# EAGLE design Rev 1 (EAGLE 7.2.0)
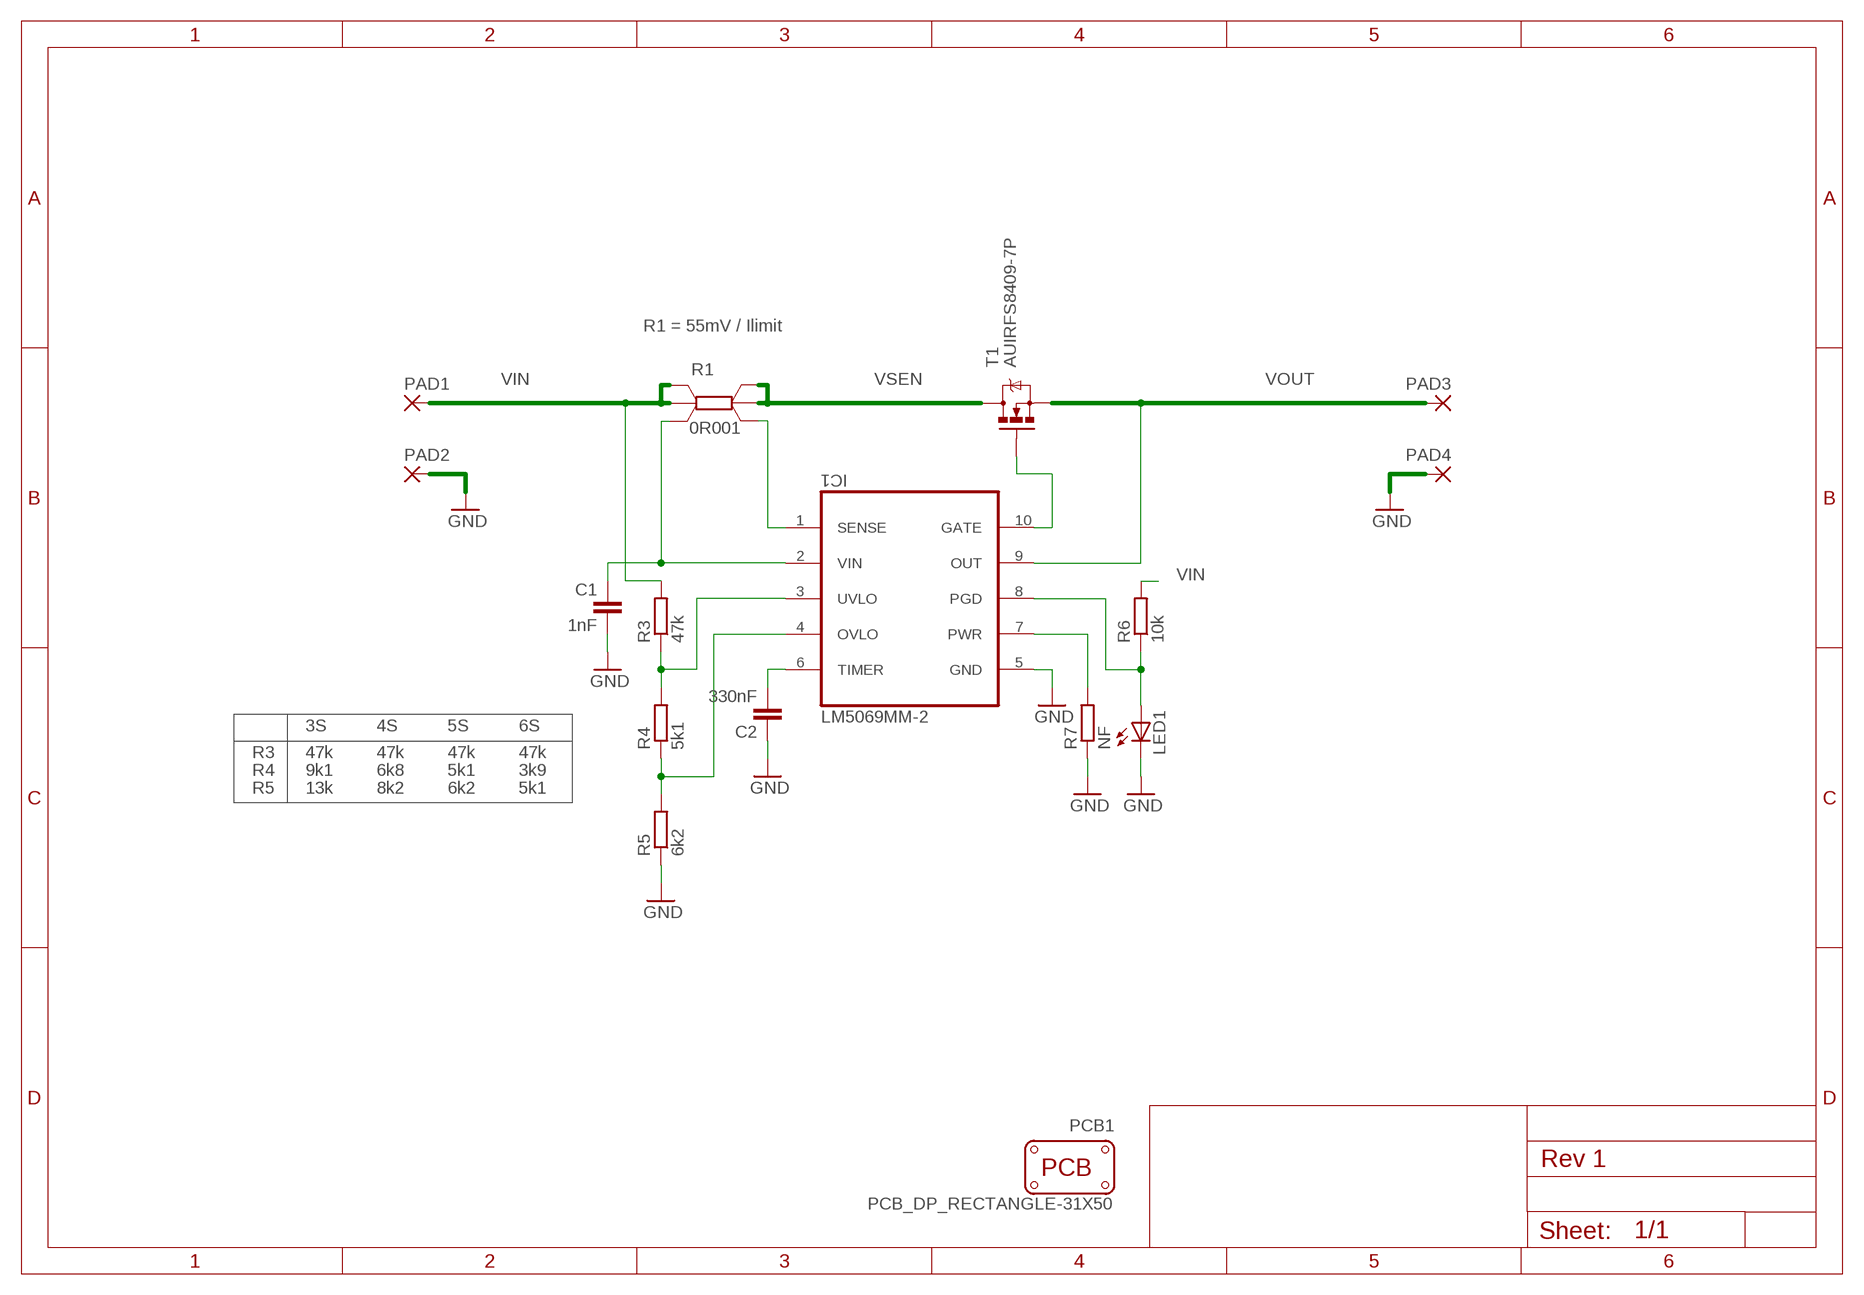
[diagram p0: schematic, sheet 1]

## Parts
C1  1nF  C-EUC0603  [C0603]
C2  330nF  C-EUC0603  [C0603]
IC1  LM5069MM-2  [SOP50P490X110-10N]
LED1  LED-0805  [LED-805]
PAD1  SMD7  [SMD3,81-7,62]
PAD2  SMD7  [SMD3,81-7,62]
PAD3  SMD7  [SMD3,81-7,62]
PAD4  SMD7  [SMD3,81-7,62]
PCB1  PCB_DP_RECTANGLE-31X50  [DP5031_V1]
R1  0R001  OARS_XP  [OARS_SP_4PAD]
R3  47k  R-EU_R0603  [R0603]
R4  5k1  R-EU_R0603  [R0603]
R5  6k2  R-EU_R0603  [R0603]
R6  10k  R-EU_R0603  [R0603]
R7  NF  R-EU_R0603  [R0603]
T1  AUIRFS8409-7P  IRFS7437-7PPBF  [TO263-6]

## Nets
CTIMER: C2.2 IC1.6(TIMER)
GATE_DRIVE: IC1.10(GATE) T1.1(G)
GND: C1.2 C2.1 IC1.5(GND) LED1.C PAD2.1(P) PAD4.1(P) R5.1 R7.1
OVLO: IC1.4(OVLO) R4.1 R5.2
PGD: IC1.8(PGD) LED1.A R6.1
POWER: IC1.7(PWR) R7.2
SENSE: IC1.1(SENSE) R1.AK
UVLO: IC1.3(UVLO) R3.1 R4.2
VIN: PAD1.1(P) R1.B1 R1.B2 R3.2 R6.2
VIN_K: C1.1 IC1.2(VIN) R1.BK
VOUT: IC1.9(OUT) PAD3.1(P) T1.2(S) T1.3(S) T1.4(S) T1.5(S) T1.6(S)
VSEN: R1.A1 R1.A2 T1.TH(D)

## Notes on the sheet
- R1 = 55mV / Ilimit
- 3S | 4S | 5S | 6S
- R3 | 47k | 47k | 47k | 47k
- R4 | 9k1 | 6k8 | 5k1 | 3k9
- R5 | 13k | 8k2 | 6k2 | 5k1

## Library data of the parts
C1 = rcl:C-EU: CAPACITOR, European symbol; MF: VISHAY; MPN: VJ0603Y102KXBAC31; OC_FARNELL: 2407359
C2 = rcl:C-EU: CAPACITOR, European symbol; MF: TDK; MPN: C1608X7R1E334K080AC; OC_FARNELL: 2346902
IC1 = general:LM5069MM-2: Current controller; MF: TEXAS INSTRUMENTS; MPN: LM5069MM-2; OC_FARNELL: 1290933; OC_NEWARK: 13M1902; PACKAGE: MSOP-10; SUPPLIER: National
LED1 = dp_devices:LED: Light Emitting Diode; MF: ROHM; MPN: SML-211UTT86K; OC_FARNELL: 1685056
PAD1-PAD4 = wirepad:SMD7; OC_FARNELL: unknown
PCB1 = dp_devices:PCB_DP_RECTANGLE: Dangerous Prototypes Standard Rectangular PCB sizes; OC_FARNELL: unknown
R1 = general:OARS_XP; MF: INTERNATIONAL RESISTIVE; MPN: OARSXPR001FLF; OC_FARNELL: 2112985
R3 = rcl:R-EU_: RESISTOR, European symbol; MF: YAGEO (PHYCOMP); MPN: RC0603FR-0747KL; OC_FARNELL: 9238689
R4 = rcl:R-EU_: RESISTOR, European symbol; MF: VISHAY DRALORIC; MPN: CRCW02015K10FNED; OC_FARNELL: 2140154
R5 = rcl:R-EU_: RESISTOR, European symbol; MF: VISHAY DRALORIC; MPN: CRCW06036K20FKEA; OC_FARNELL: 2138408
R6 = rcl:R-EU_: RESISTOR, European symbol; MF: TE CONNECTIVITY; MPN: CRGH0603J10K; OC_FARNELL: 2331740
R7 = rcl:R-EU_: RESISTOR, European symbol; OC_FARNELL: unknown
T1 = general:IRFS7437-7PPBF: MOSFET, N-CH, 40V, 195A, 7-D2PAK; Transistor Polarity:N Channel; Continuous Drain Current Id:195A; Drain Source Voltage Vds:40V; On Resistance Rds(on):0.0011ohm; Rds(on) Test Voltage Vgs:10V; Power Dissipation Pd:231W; Operating Temperature Min:-55°C; Operating Temperature Max:175°C; Transistor Case Style:TO-263; No. of Pins:7; MSL:MSL 1 - Unlimited; SVHC:No SVHC (20-Jun-2013); Operating Temperature Range:-55°C to +175°C; MF: INTERNATIONAL RECTIFIER; MPN: AUIRFS8409-7P; OC_FARNELL: 2352041

## Board
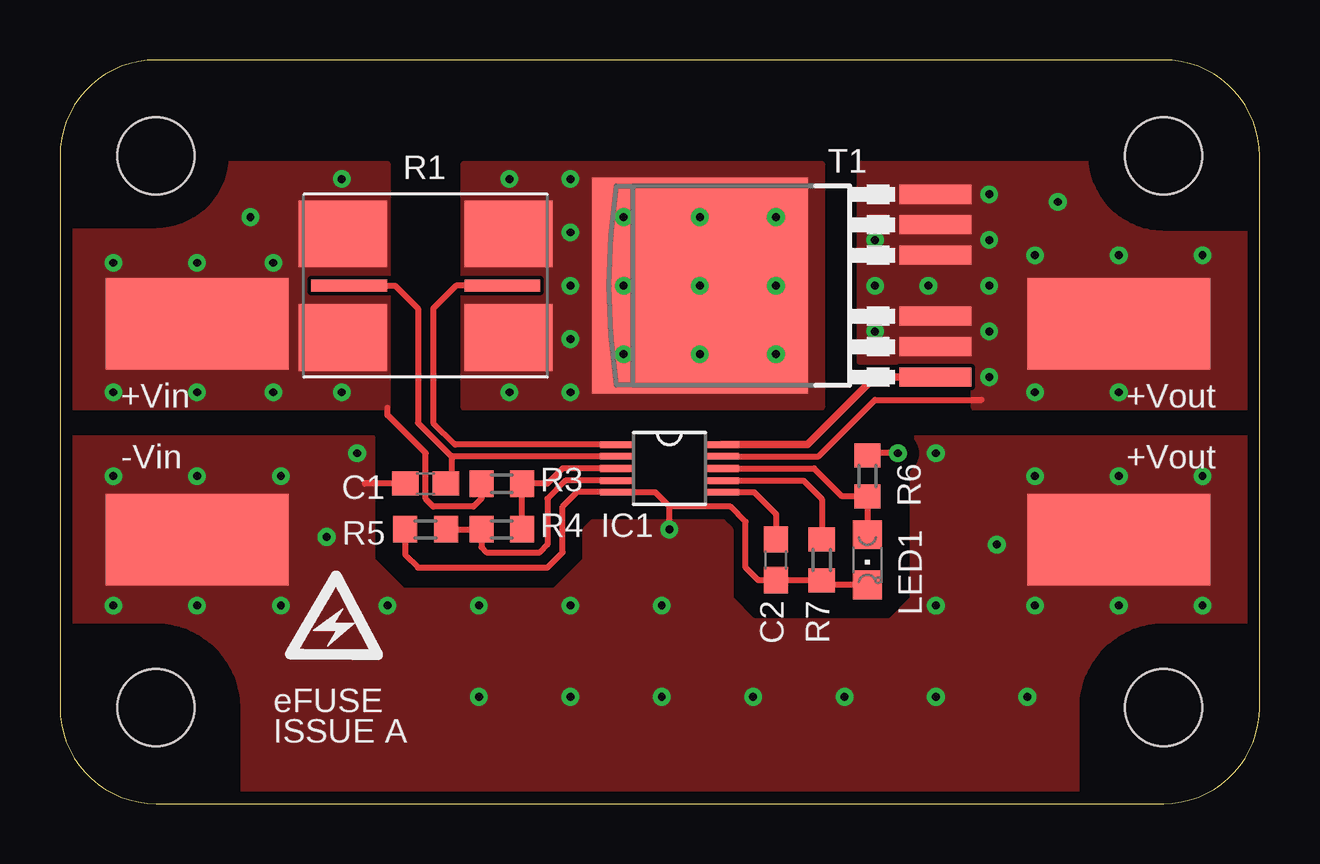
[diagram p1: board, top side]
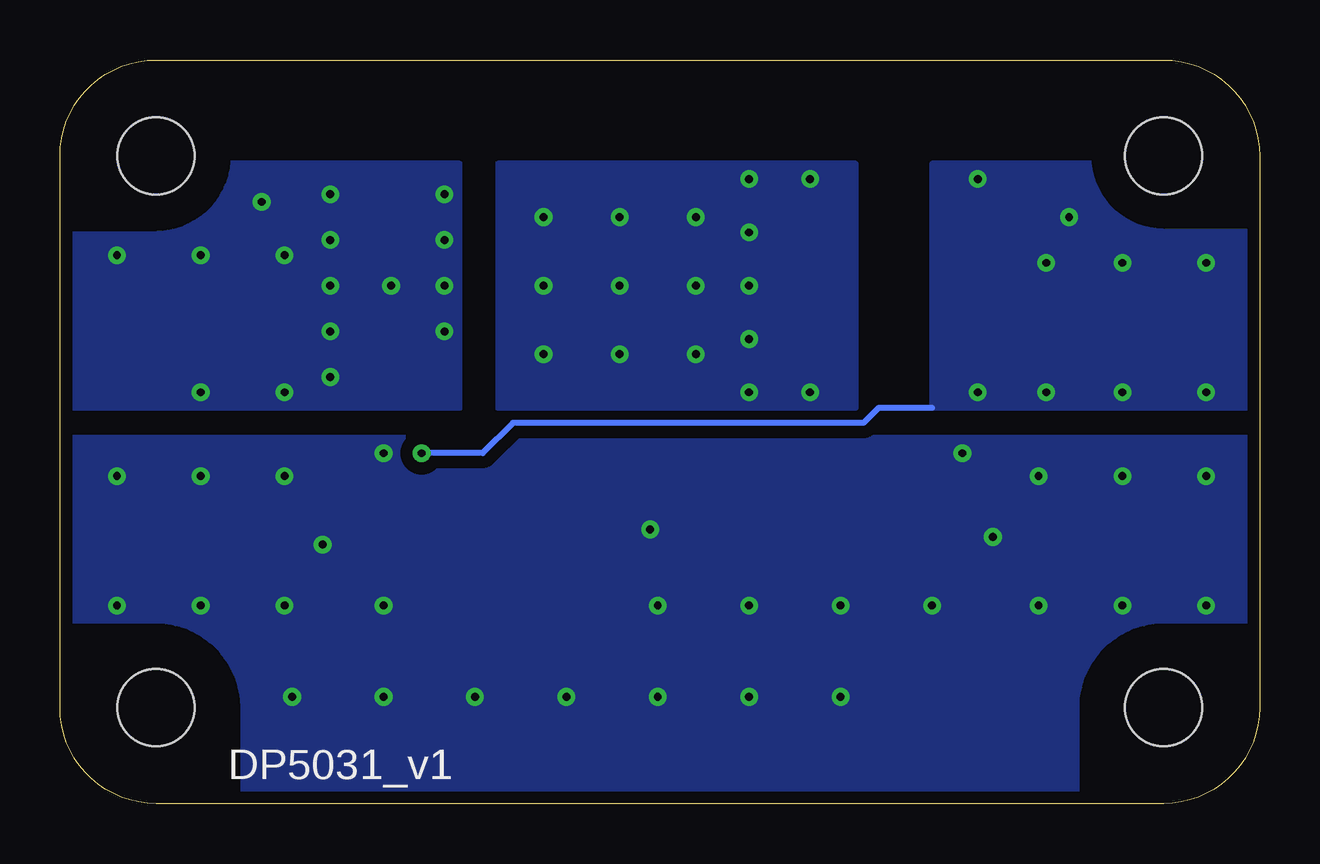
[diagram p2: board, bottom side, seen from below]

Size 50 x 31 mm. Coordinates in mm from the lower left corner, seen from the top.
Copper layers (1*16): Top 0.035mm / dielectric 1.5mm / Bottom 0.035mm
Design rules "Ragworm": minimum track width 6mil, minimum drill 20mil, track to track 6mil, track to pad 6mil, pad to pad 6mil, via to via 6mil, smd to smd 6mil, copper to edge 20mil, drill to drill 8mil, minimum pad ring 10mil, minimum via ring 8mil, stop-mask expansion 4mil, vias tented up to drill 0mil, thermal gap 10mil

### Footprints (pad centres in the part's own frame; a part is rotated, then mirrored left to right if it is on the bottom)
C0603 = smd 1.1 x 1: 1 -0.85,0; 2 0.85,0
SOP50P490X110-10N = smd 1.422 x 0.279: 1 -2.184,0.991; 2 -2.184,0.508; 3 -2.184,0; 4 -2.184,-0.508; 5 -2.184,-0.991; 6 2.184,-0.991; 7 2.184,-0.508; 8 2.184,0; 9 2.184,0.508; 10 2.184,0.991
LED-805 = smd 1.2 x 1.2: A 0,-1.05; C 0,1.05
SMD3,81-7,62 = smd 3.81 x 7.62: 1 0,0
DP5031_V1 = hole 3.2: 4,4; 46,4; 46,27; 4,27
OARS_SP_4PAD = smd 3.67 x 2.79: A1 -3.45,2.16; A2 -3.45,-2.16; B1 3.45,2.16; B2 3.45,-2.16 | smd 3.16 x 0.51: AK -3.195,0; BK 3.195,0
R0603 = smd 1 x 1.1: 1 -0.85,0; 2 0.85,0
TO263-6 = smd 0.8 x 3: 1 -3.81,-3.475; 2 -2.54,-3.475; 3 -1.27,-3.475; 4 1.27,-3.475; 5 2.54,-3.475; 6 3.81,-3.475 | smd 9 x 9: TH 0,6.35

### Placement (x,y rotation side)
C1  15.24,13.34 180 top
C2  29.84,10.16 90 top
IC1  25.4,13.97 0 top
LED1  33.66,10.16 180 top
PAD1  5.71,20 270 top
PAD2  5.71,11 90 top
PAD3  44.13,20 270 top
PAD4  44.13,11 90 top
PCB1  0,0 0 top
R1  15.24,21.59 180 top
R3  18.41,13.34 180 top
R4  18.41,11.43 0 top
R5  15.24,11.43 0 top
R6  33.66,13.65 90 top
R7  31.75,10.16 90 top
T1  33.02,21.59 90 top

### Tracks (layer width: path | path; a pad name or v marks a point on that pad's centre or on a via)
CTIMER
  Top 0.254: IC1.6 28.93,12.98 29.84,12.06 C2.2
GATE_DRIVE
  Top 0.305: T1.1 33.97,17.78 31.15,14.96 IC1.10
GND  (via drill 0.33)
  Top 0.254: R5.1 14.39,10.38 14.92,9.84 20.32,9.84 20.95,10.48 20.95,12.38 21.55,12.98 IC1.5 24.8,12.98 25.4,12.38 | LED1.C 31.95,9.11 R7.1 C2.1 29.11,9.31 28.57,9.84 28.57,11.75 27.94,12.38 25.4,12.38 | v25.4,11.43 25.4,12.38 | C1.2 12.7,13.34
  other vias: 12.38,14.61 36.51,14.61 2.22,8.26 2.22,13.65 9.21,13.65 9.21,8.26 5.71,8.26 5.71,13.65 11.11,11.11 40.64,13.65 40.64,8.26 44.13,8.26 44.13,13.65 47.62,13.65 47.62,8.26 39.05,10.79 36.51,8.26 36.51,4.45 40.32,4.45 32.7,4.45 28.89,4.45 25.08,4.45 21.27,4.45 17.46,4.45 17.46,8.26 21.27,8.26 25.08,8.26 13.65,8.26
  pour Top (isolate 0.508, no thermals): 0,15.24 13.02,15.24 13.02,10.16 14.29,8.89 20.64,8.89 21.91,10.16 21.91,11.43 22.23,11.75 27.62,11.75 27.94,11.43 27.94,8.57 28.89,7.62 34.61,7.62 35.56,8.57 35.56,15.24 49.53,15.24 49.53,0 0,0
  pour Bottom (isolate 0.508, no thermals): 0,15.24 49.53,15.24 49.53,0 0,0
OVLO
  Top 0.254: IC1.4 21.08,13.46 20.32,12.7 20.32,10.79 20,10.48 17.78,10.48 17.57,10.69 R4.1 R5.2
PGD
  Top 0.254: IC1.8 31.43,13.97 32.6,12.8 R6.1 LED1.A
POWER
  Top 0.254: IC1.7 30.99,13.46 31.75,12.7 R7.2
SENSE
  Top 0.254: IC1.1 16.47,14.96 15.56,15.88 15.56,20.64 16.51,21.59 R1.AK
UVLO
  Top 0.254: IC1.3 20.95,13.97 20.32,13.34 R3.1 R4.2
VIN  (via drill 0.33)
  Top 0.254: v34.92,14.61 33.76,14.61 arc90 R6.2 | R3.2 17.57,12.72 17.23,12.38 15.56,12.38 15.24,12.7 15.24,14.61 13.65,16.19 13.65,16.51
  Bottom 0.254: 13.65,16.51 15.88,16.51 16.51,15.88 31.11,15.88 32.38,14.61 v34.92,14.61
  other vias: 11.75,17.14 11.75,26.04 8.89,17.14 5.71,17.14 2.22,17.14 2.22,22.54 5.71,22.54 8.89,22.54 7.94,24.45
  pour Bottom (isolate 0.001, no thermals): 0,26.67 13.65,26.67 13.65,16.51 0,16.51
  pour Top (isolate 0.001, no thermals): 0,26.67 13.65,26.67 13.65,16.51 0,16.51
VIN_K
  Top 0.254: 16.32,14.48 14.92,15.88 14.92,20.64 13.97,21.59 R1.BK | IC1.2 16.32,14.48 | 16.32,14.48 16.32,13.56 C1.1
VOUT  (via drill 0.33)
  Top 0.254: IC1.9 31.62,14.48 33.97,16.83 38.42,16.83
  other vias: 38.73,21.59 36.2,21.59 38.73,23.5 38.73,25.4 38.73,19.68 38.73,17.78 33.97,21.59 33.97,23.5 33.97,25.4 33.97,19.68 40.64,22.86 44.13,22.86 47.62,22.86 40.64,17.14 44.13,17.14 41.59,25.08
  pour Bottom (isolate 0.127, no thermals): 33.34,26.67 49.53,26.67 49.53,16.51 33.34,16.51
  pour Top (isolate 0.127, no thermals): 33.34,26.67 49.53,26.67 49.53,16.51 38.1,16.51 38.1,18.41 33.34,18.41
VSEN  (via drill 0.33)
  other vias: 18.73,26.04 23.5,18.73 23.5,24.45 29.84,24.45 29.84,18.73 26.67,21.59 18.73,17.14 21.27,26.04 21.27,23.81 21.27,21.59 21.27,19.37 21.27,17.14 23.5,21.59 29.84,21.59 26.67,24.45 26.67,18.73
  pour Top (isolate 0.001, no thermals): 16.83,26.67 31.75,26.67 31.75,16.51 16.83,16.51
  pour Bottom (isolate 0.001, no thermals): 16.83,26.67 31.75,26.67 31.75,16.51 16.83,16.51

### Text on the board
tPlace: +Vin | +Vout | -Vin | +Vout | eFUSE | ISSUE A | C:/Users/TheFallen/Desktop/img001.bmp | C:/Users/TheFallen/Desktop/img001.bmp | C:/Users/TheFallen/Desktop/img001.bmp